# EAGLE schematic MIB-BAT (EAGLE 7.6.0)
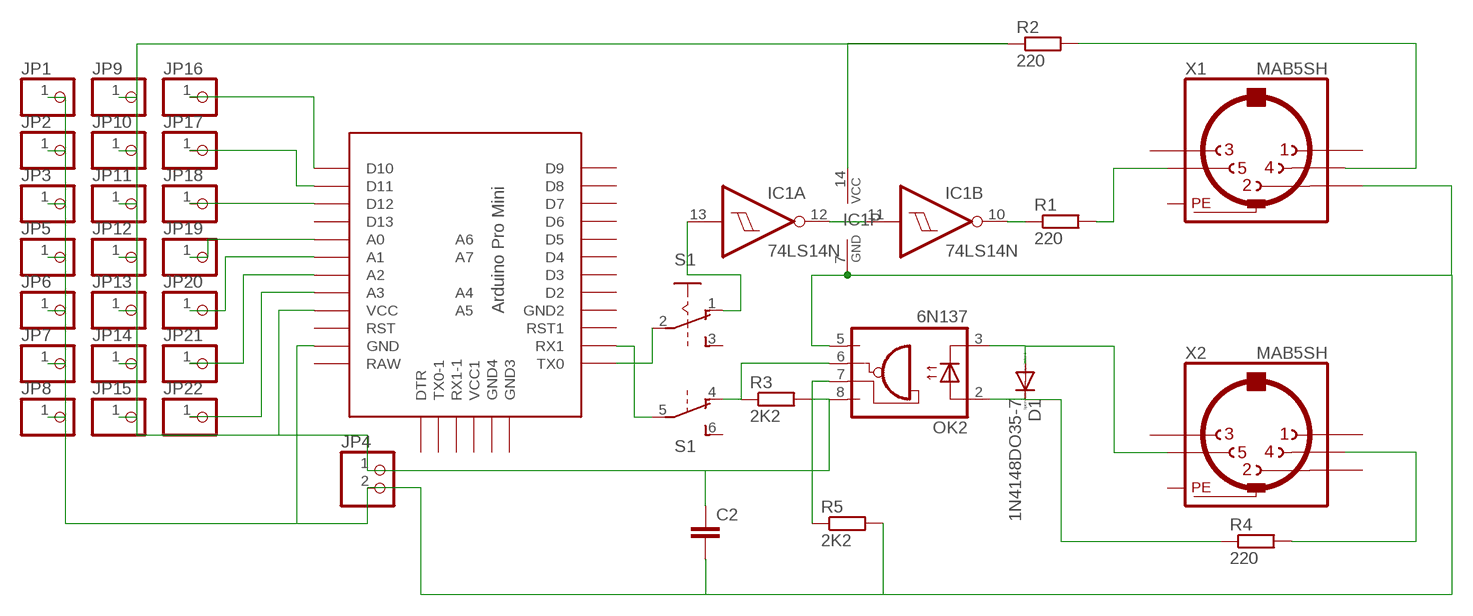
[diagram p0: schematic, sheet 1]

## Parts
C2  C7.5/3  [C7.5B3]
D1  1N4148DO35-7  [DO35-7]
IC1  74LS14N  [DIL14]
JP1  PINHD-1X1  [1X01]
JP2  PINHD-1X1  [1X01]
JP3  PINHD-1X1  [1X01]
JP4  PINHD-1X2  [1X02]
JP5  PINHD-1X1  [1X01]
JP6  PINHD-1X1  [1X01]
JP7  PINHD-1X1  [1X01]
JP8  PINHD-1X1  [1X01]
JP9  PINHD-1X1  [1X01]
JP10  PINHD-1X1  [1X01]
JP11  PINHD-1X1  [1X01]
JP12  PINHD-1X1  [1X01]
JP13  PINHD-1X1  [1X01]
JP14  PINHD-1X1  [1X01]
JP15  PINHD-1X1  [1X01]
JP16  PINHD-1X1  [1X01]
JP17  PINHD-1X1  [1X01]
JP18  PINHD-1X1  [1X01]
JP19  PINHD-1X1  [1X01]
JP20  PINHD-1X1  [1X01]
JP21  PINHD-1X1  [1X01]
JP22  PINHD-1X1  [1X01]
OK2  6N137  [DIL08]
R1  220  R-EU_0207/10  [0207/10]
R2  220  R-EU_0207/10  [0207/10]
R3  2K2  R-EU_0207/10  [0207/10]
R4  220  R-EU_0207/10  [0207/10]
R5  2K2  R-EU_0207/10  [0207/10]
S1  A68-A31  [A68-A31]
U$1  PRO-MINI-2  [PRO-MINI-2]
X1  MAB5SH  [MAB5SH]
X2  MAB5SH  [MAB5SH]

## Nets
N$1: S1.5(B:P) U$1.RX1
N$2: IC1.11(B:I) IC1.12(A:O)
N$3: IC1.10(B:O) R1.1
N$4: D1.C OK2.2(A) R4.1
N$5: R4.2 X2.4
N$6: D1.A OK2.3(C) X2.5
N$7: R1.2 X1.5
N$8: R2.2 X1.4
N$10: OK2.6(VO) R3.1 S1.4(B:O)
N$11: C2.2 IC1.7(P:GND) JP1.1 JP2.1 JP3.1 JP4.2 JP5.1 JP6.1 JP7.1 JP8.1 OK2.5(GND) R5.2 U$1.GND X1.2
N$13: JP16.1 U$1.D10
N$14: JP17.1 U$1.D11
N$15: C2.1 IC1.14(P:VCC) JP4.1 JP9.1 JP10.1 JP11.1 JP12.1 JP13.1 JP14.1 JP15.1 OK2.8(VCC) R2.1 R3.2 U$1.VCC
N$16: JP18.1 U$1.D12
N$18: JP19.1 U$1.A0
N$19: JP20.1 U$1.A1
N$23: S1.2(A:P) U$1.TX0
N$29: JP21.1 U$1.A2
N$30: JP22.1 U$1.A3
N$41: OK2.7(VE) R5.1
N$42: IC1.13(A:I) S1.1(A:O)
Unconnected: IC1.1(D:I) IC1.2(D:O) IC1.3(E:I) IC1.4(E:O) IC1.5(F:I) IC1.6(F:O) IC1.8(C:O) IC1.9(C:I) S1.3(A:S) S1.6(B:S) U$1.A4 U$1.A5 U$1.A6 U$1.A7 U$1.D2 U$1.D3 U$1.D4 U$1.D5 U$1.D6 U$1.D7 U$1.D8 U$1.D9 U$1.D13 U$1.DTR U$1.GND1(GND2) U$1.GND2(GND3) U$1.GND3(GND4) U$1.RAW U$1.RST U$1.RST1 U$1.RX1-1 U$1.TX0-1 U$1.VCC1 X1.1 X1.3 X2.1 X2.2 X2.3

## Power pins joined to a net without a drawn wire
PE: X1.PE X1.PE@(PE) X2.PE X2.PE@(PE)

## Library data of the parts
C2 = capacitor-wima:C: CAPACITOR naming: grid - package width
D1 = diode:1N4148: DIODE high speed (Philips)
IC1 = 74xx-eu:74*14: Hex schmitt trigger INVERTER
JP1-JP3 JP5-JP22 = pinhead:PINHD-1X1: PIN HEADER
JP4 = pinhead:PINHD-1X2: PIN HEADER
OK2 = optocoupler:6N137: MOTOROLA OPTO COUPLER; MPN: 6N137; OC_FARNELL: 1328376; OC_NEWARK: 52M1895
R1-R5 = rcl:R-EU_: RESISTOR, European symbol
S1 = switch:A68-A31: SLIDING SWITCH Siemens, distributor Buerklin, 11G766
U$1 = Arduino-clone:PRO-MINI-2: Arduino Pro Mini Layout 2 Sparkfun.com
X1 X2 = con-hirschmann:MAB5SH: Female CONNECTOR 5 pins 90 deg. with shield, horizontal (DIN 41524); OC_FARNELL: 809883; OC_NEWARK: unknown